# Altium project MyCar.PrjPCB
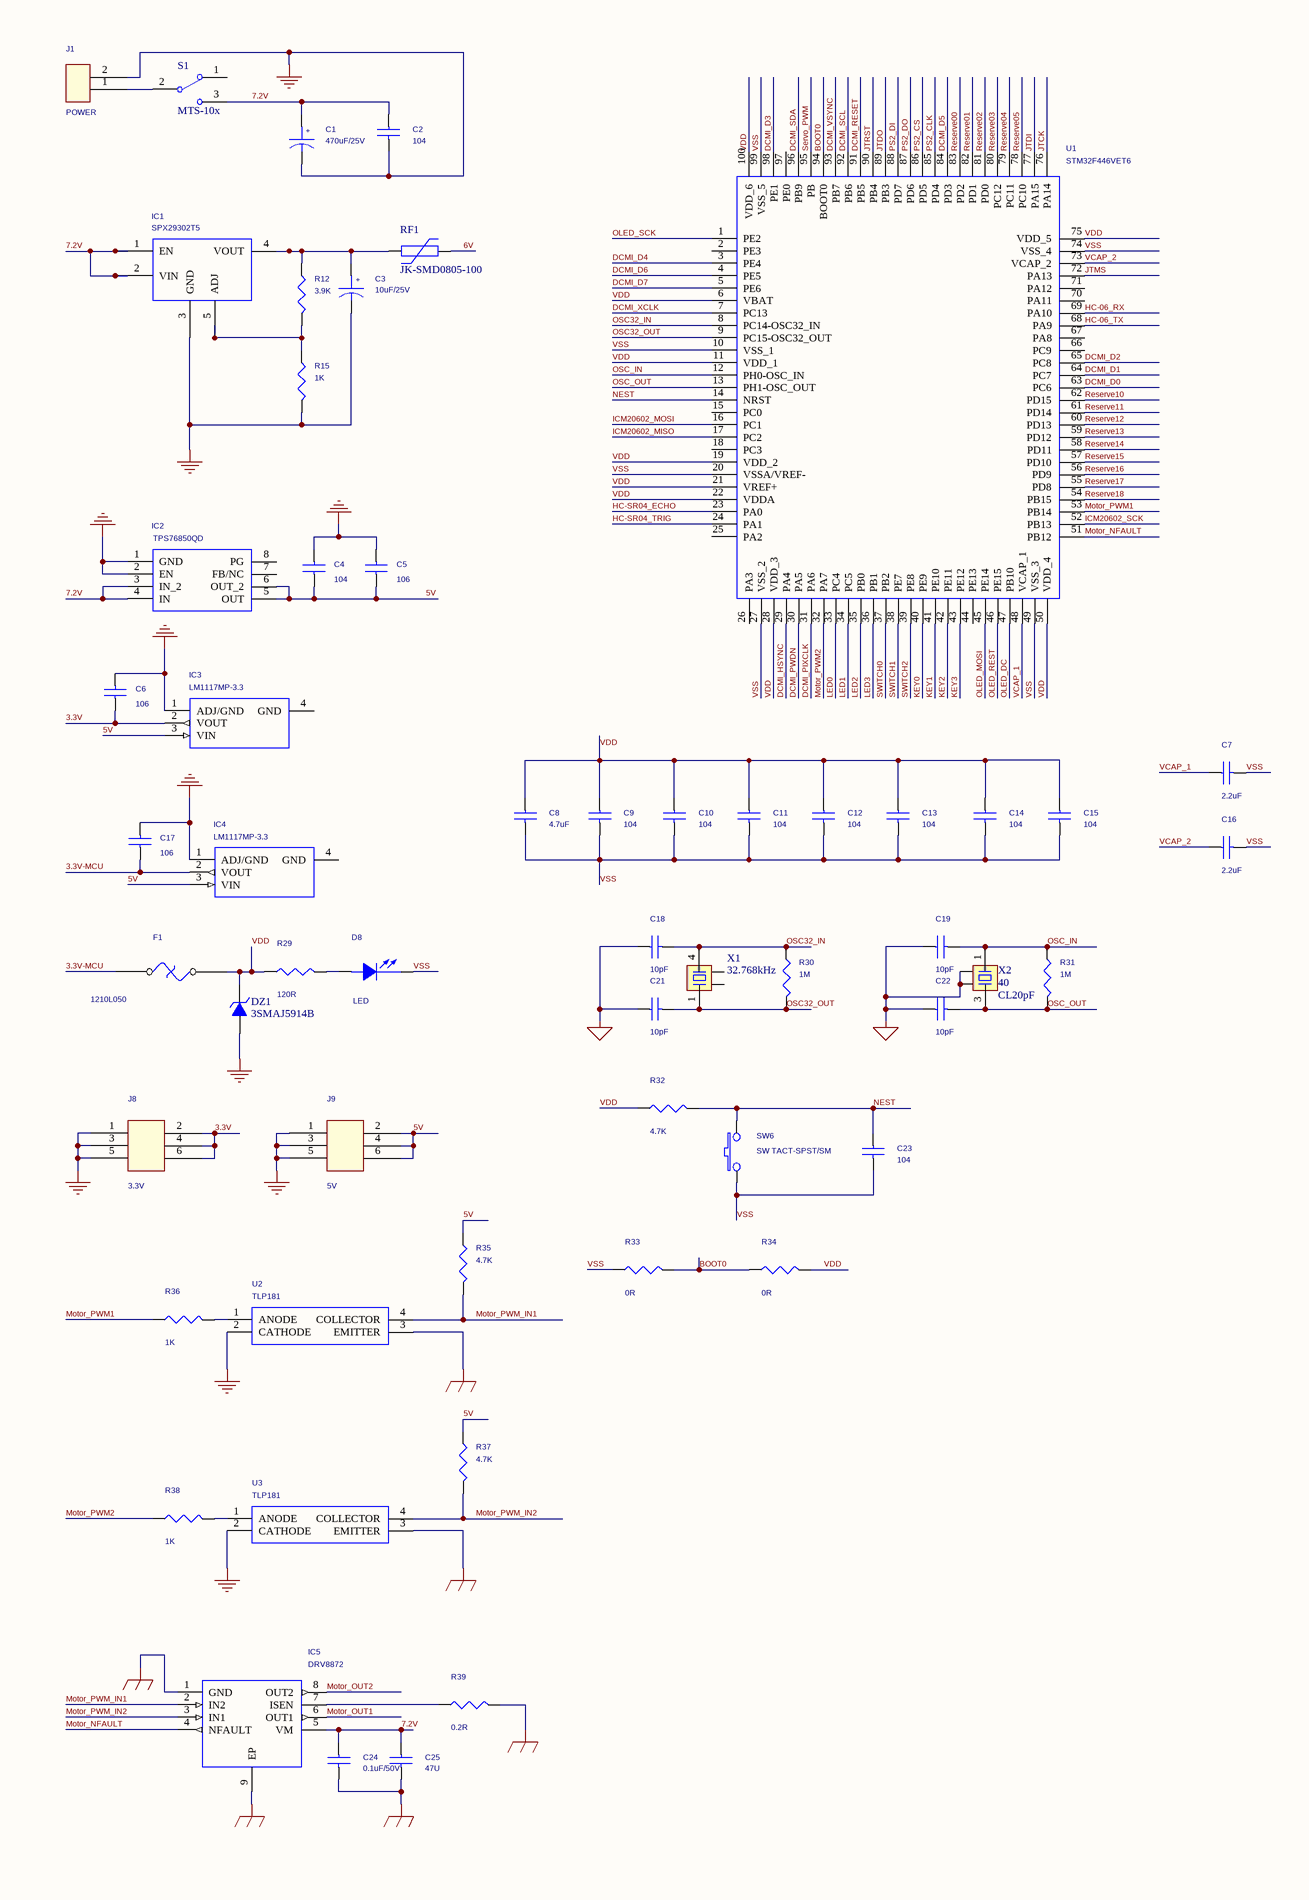
[diagram p0: MyCar.SchDoc, left]
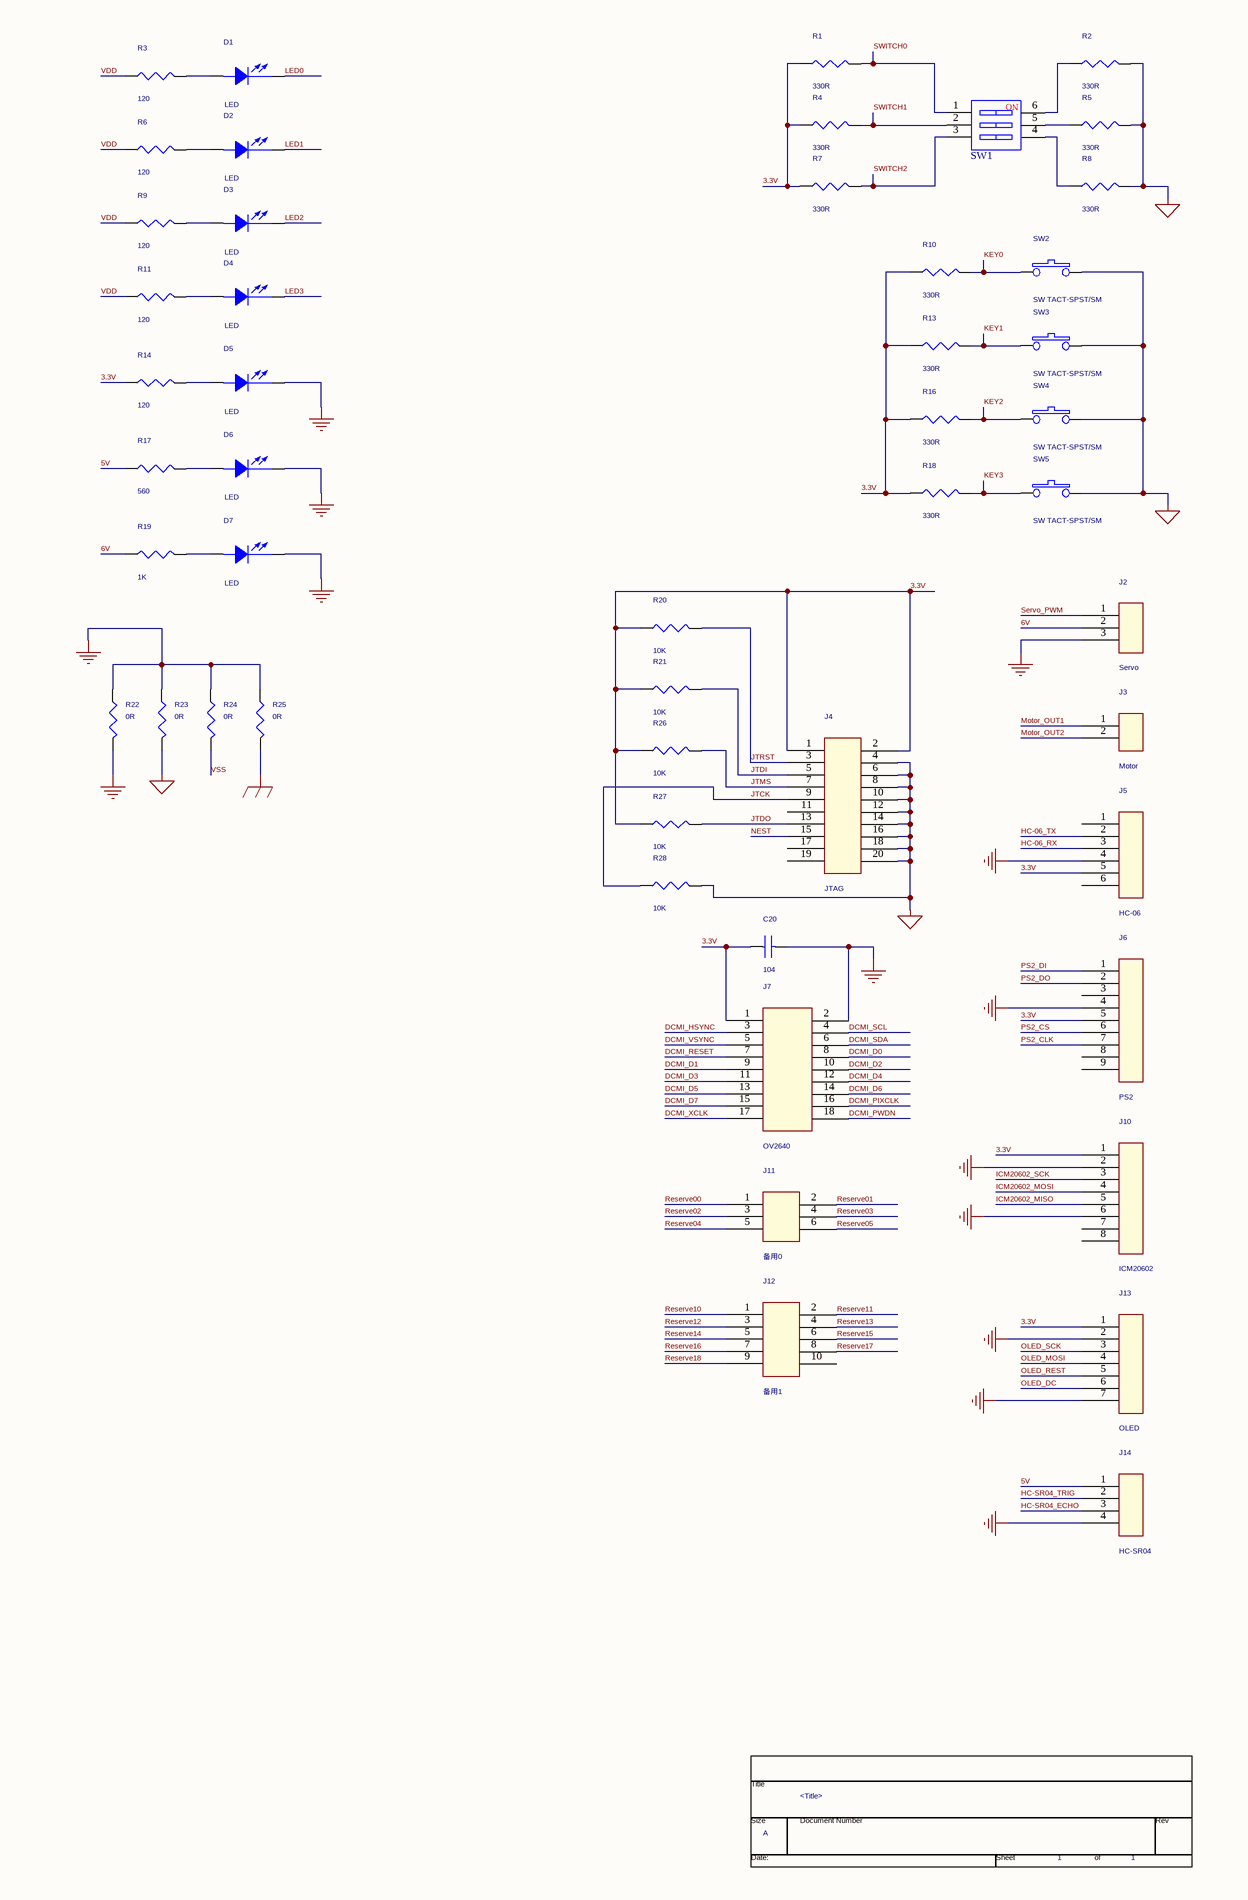
[diagram p1: MyCar.SchDoc, right]
1 sheet, 107 parts. Net scope: global (net labels, ports and power ports of the same name join across sheets).
Board file: MyCar.PcbDoc

## Sheet MyCar.SchDoc
size 513 x 386 mm

### Parts
*  Title: <Title>  Page Size: A  Page Number: 1  (hidden comment: TitleBlock0)  (graphical)
C1  470uF/25V  [CAP 3.5*8*11.5]
C2  104  [C 0805_M]
C3  10uF/25V  [CAP 2.0*5*7]
C4  104  [C 0805_M]
C5  106  [C 0805_M]
C6  106  [C 0805_M]
C7  2.2uF  [CD A(3216)]
C8  4.7uF  [C 1210_M]
C9  104  [C 0805_M]
C10  104  [C 0805_M]
C11  104  [C 0805_M]
C12  104  [C 0805_M]
C13  104  [C 0805_M]
C14  104  [C 0805_M]
C15  104  [C 0805_M]
C16  2.2uF  [CD A(3216)]
C17  106  [C 0805_M]
C18  10pF  [C 0805_M]
C19  10pF  [C 0805_M]
C20  104  [C 0805_M]
C21  10pF  [C 0805_M]
C22  10pF  [C 0805_M]
C23  104  [C 0805_M]
C24  0.1uF/50V  [C 0603_M]
C25  47U  [CAP 2.5*5*11]
D1  LED  [LED 0805R]
D2  LED  [LED 0805R]
D3  LED  [LED 0805R]
D4  LED  [LED 0805R]
D5  LED  [LED 0805R]
D6  LED  [LED 0805R]
D7  LED  [LED 0805R]
D8  LED  [LED 0805R]
DZ1  3SMAJ5914B  [SMA DO-214AC]
F1  1210L050  [0805]
IC1  SPX29302T5  [TO-263-5]
IC2  TPS76850QD  [SOIC-8]
IC3  LM1117MP-3.3  [SOT-223]
IC4  LM1117MP-3.3  [SOT-223]
IC5  DRV8872  [SOP-8]
J1  POWER  [KF2EDGK5.08-LI-2P]
J2  Servo  [HDR2.54-LI-3P]
J3  Motor  [KF2EDGK5.08-LI-2P]
J4  JTAG  [DC-2.54-L-Z-20P]
J5  HC-06  [HDR2.54-LI-6P]
J6  PS2  [PS2]
J7  OV2640  [HDR2.54-LI-2x9P]
J8  3.3V  [HDR2.54-LI-2x3P]
J9  5V  [HDR2.54-LI-2x3P]
J10  ICM20602  [HDR2.54-LI-8P]
J11  备用0  [HDR2.54-LI-2x3P]
J12  备用1  [HDR2.54-LI-2x5P]
J13  OLED  [HDR2.54-LI-7P]
J14  HC-SR04  [HDR2.54-LI-4P]
R1  330R  [R 0805_M]
R2  330R  [R 0805_M]
R3  120  [R 0805_M]
R4  330R  [R 0805_M]
R5  330R  [R 0805_M]
R6  120  [R 0805_M]
R7  330R  [R 0805_M]
R8  330R  [R 0805_M]
R9  120  [R 0805_M]
R10  330R  [R 0805_M]
R11  120  [R 0805_M]
R12  3.9K  [R 0805_M]
R13  330R  [R 0805_M]
R14  120  [R 0805_M]
R15  1K  [R 0805_M]
R16  330R  [R 0805_M]
R17  560  [R 0805_M]
R18  330R  [R 0805_M]
R19  1K  [R 0805_M]
R20  10K  [R 0805_M]
R21  10K  [R 0805_M]
R22  0R  [R 0805_M]
R23  0R  [R 0805_M]
R24  0R  [R 0805_M]
R25  0R  [R 0805_M]
R26  10K  [R 0805_M]
R27  10K  [R 0805_M]
R28  10K  [R 0805_M]
R29  120R  [R 0805_M]
R30  1M  [R 0805_M]
R31  1M  [R 0805_M]
R32  4.7K  [R 0805_M]
R33  0R  [R 0805_M]
R34  0R  [R 0805_M]
R35  4.7K  [R 0805_M]
R36  1K  [R 0805_M]
R37  4.7K  [R 0805_M]
R38  1K  [R 0805_M]
R39  0.2R  [R 1206_M]
RF1  JK-SMD0805-100  [FU 0805]
S1  MTS-10x  [MTS-10x]
SW1  CSW-3P  [CSW DIP-3P]  (value not drawn)
SW2  SW TACT-SPST/SM  [TSW DIP-6*6*4.3]
SW3  SW TACT-SPST/SM  [TSW DIP-6*6*4.3]
SW4  SW TACT-SPST/SM  [TSW DIP-6*6*4.3]
SW5  SW TACT-SPST/SM  [TSW DIP-6*6*4.3]
SW6  SW TACT-SPST/SM  [TSW DIP-6*6*4.3]
U1  STM32F446VET6  [LQFP100 14x14_N]
U2  TLP181  [SOP4_M]
U3  TLP181  [SOP4_M]
X1  32.768kHz  [OSC MC-146]
X2  40  负载电容: CL20pF  [OSC 3225-4P]

### Nets
GND: C20.2 J2.3 J5.4 J6.4 J7.2 J10.2 J10.6 J13.2 J13.7 J14.4 R22.2
GND_EARTH: C24.2 C25.2 IC5.1(GND) IC5.9(EP) R25.2 R39.2 U2.3(EMITTER) U3.3(EMITTER)
GND_POWER: C1.2 C2.2 C3.2 C4.2 C5.2 C6.2 C17.2 D5.1(CATHODE) D6.1(CATHODE) D7.1(CATHODE) DZ1.1(A) IC1.3(GND) IC2.1(GND) IC2.2(EN) IC3.1(ADJ/GND) IC4.1(ADJ/GND) J1.2 J8.1 J8.3 J8.5 J9.1 J9.3 J9.5 R15.2 R22.1 R23.1 R24.1 R25.1 U2.2(CATHODE) U3.2(CATHODE)
GND_SIGNAL: C18.1 C19.1 C21.1 C22.1 J4.4 J4.6 J4.8 J4.10 J4.12 J4.14 J4.16 J4.18 J4.20 R2.2 R5.2 R8.2 R23.2 R28.2 SW2.2 SW3.2 SW4.2 SW5.2 X2.2 X2.4
3.3V: C6.1 C20.1 IC3.2(VOUT) J4.1 J4.2 J5.5 J6.5 J7.1 J8.2 J8.4 J8.6 J10.1 J13.1 R1.1 R4.1 R7.1 R10.1 R13.1 R14.1 R16.1 R18.1 R20.1 R21.1 R26.1 R27.1
3.3V-MCU: C17.1 F1.1 IC4.2(VOUT)
5V: C4.1 C5.1 IC2.5(OUT) IC2.6(OUT_2) IC3.3(VIN) IC4.3(VIN) J9.2 J9.4 J9.6 J14.1 R17.1 R35.1 R37.1
6V: J2.2 R19.1 RF1.2
7.2V: C1.1 C2.1 C24.1 C25.1 IC1.1(EN) IC1.2(VIN) IC2.3(IN_2) IC2.4(IN) IC5.5(VM) S1.3
BOOT0: R33.2 R34.1 U1.94(BOOT0)
DCMI_D0: J7.8 U1.63(PC6)
DCMI_D1: J7.9 U1.64(PC7)
DCMI_D2: J7.10 U1.65(PC8)
DCMI_D3: J7.11 U1.98(PE1)
DCMI_D4: J7.12 U1.3(PE4)
DCMI_D5: J7.13 U1.84(PD3)
DCMI_D6: J7.14 U1.4(PE5)
DCMI_D7: J7.15 U1.5(PE6)
DCMI_HSYNC: J7.3 U1.29(PA4)
DCMI_PIXCLK: J7.16 U1.31(PA6)
DCMI_PWDN: J7.18 U1.30(PA5)
DCMI_RESET: J7.7 U1.91(PB5)
DCMI_SCL: J7.4 U1.92(PB6)
DCMI_SDA: J7.6 U1.96(PB9)
DCMI_VSYNC: J7.5 U1.93(PB7)
DCMI_XCLK: J7.17 U1.7(PC13)
HC-06_RX: J5.3 U1.69(PA10)
HC-06_TX: J5.2 U1.68(PA9)
HC-SR04_ECHO: J14.3 U1.23(PA0)
HC-SR04_TRIG: J14.2 U1.24(PA1)
ICM20602_MISO: J10.5 U1.17(PC2)
ICM20602_MOSI: J10.4 U1.16(PC1)
ICM20602_SCK: J10.3 U1.52(PB13)
JTCK: J4.9 R28.1 U1.76(PA14)
JTDI: J4.5 R21.2 U1.77(PA15)
JTDO: J4.13 R27.2 U1.89(PB3)
JTMS: J4.7 R26.2 U1.72(PA13)
JTRST: J4.3 R20.2 U1.90(PB4)
KEY0: R10.2 SW2.1 U1.40(PE9)
KEY1: R13.2 SW3.1 U1.41(PE10)
KEY2: R16.2 SW4.1 U1.42(PE11)
KEY3: R18.2 SW5.1 U1.43(PE12)
LED0: D1.1(CATHODE) U1.33(PC4)
LED1: D2.1(CATHODE) U1.34(PC5)
LED2: D3.1(CATHODE) U1.35(PB0)
LED3: D4.1(CATHODE) U1.36(PB1)
Motor_NFAULT: IC5.4(NFAULT) U1.51(PB12)
Motor_OUT1: IC5.6(OUT1) J3.1
Motor_OUT2: IC5.8(OUT2) J3.2
Motor_PWM1: R36.1 U1.53(PB14)
Motor_PWM2: R38.1 U1.32(PA7)
Motor_PWM_IN1: IC5.2(IN2) R35.2 U2.4(COLLECTOR)
Motor_PWM_IN2: IC5.3(IN1) R37.2 U3.4(COLLECTOR)
NEST: C23.1 J4.15 R32.2 SW6.2 U1.14(NRST)
OLED_DC: J13.6 U1.47(PB10)
OLED_MOSI: J13.4 U1.45(PE14)
OLED_REST: J13.5 U1.46(PE15)
OLED_SCK: J13.3 U1.1(PE2)
OSC32_IN: C18.2 R30.1 U1.8(PC14-OSC32_IN) X1.4
OSC32_OUT: C21.2 R30.2 U1.9(PC15-OSC32_OUT) X1.1
OSC_IN: C19.2 R31.1 U1.12(PH0-OSC_IN) X2.1
OSC_OUT: C22.2 R31.2 U1.13(PH1-OSC_OUT) X2.3
PS2_CLK: J6.7 U1.85(PD4)
PS2_CS: J6.6 U1.86(PD5)
PS2_DI: J6.1 U1.88(PD7)
PS2_DO: J6.2 U1.87(PD6)
Reserve00: J11.1 U1.83(PD2)
Reserve01: J11.2 U1.82(PD1)
Reserve02: J11.3 U1.81(PD0)
Reserve03: J11.4 U1.80(PC12)
Reserve04: J11.5 U1.79(PC11)
Reserve05: J11.6 U1.78(PC10)
Reserve10: J12.1 U1.62(PD15)
Reserve11: J12.2 U1.61(PD14)
Reserve12: J12.3 U1.60(PD13)
Reserve13: J12.4 U1.59(PD12)
Reserve14: J12.5 U1.58(PD11)
Reserve15: J12.6 U1.57(PD10)
Reserve16: J12.7 U1.56(PD9)
Reserve17: J12.8 U1.55(PD8)
Reserve18: J12.9 U1.54(PB15)
Servo_PWM: J2.1 U1.95(PB)
SWITCH0: R1.2 SW1.1 U1.37(PB2)
SWITCH1: R4.2 SW1.2 U1.38(PE7)
SWITCH2: R7.2 SW1.3 U1.39(PE8)
VCAP_1: C7.1 U1.48(VCAP_1)
VCAP_2: C16.1 U1.73(VCAP_2)
VDD: C8.1 C9.1 C10.1 C11.1 C12.1 C13.1 C14.1 C15.1 DZ1.2(K) F1.2 R3.1 R6.1 R9.1 R11.1 R29.1 R32.1 R34.2 U1.6(VBAT) U1.11(VDD_1) U1.19(VDD_2) U1.21(VREF+) U1.22(VDDA) U1.28(VDD_3) U1.50(VDD_4) U1.75(VDD_5) U1.100(VDD_6)
VSS: C7.2 C8.2 C9.2 C10.2 C11.2 C12.2 C13.2 C14.2 C15.2 C16.2 C23.2 D8.1(CATHODE) R24.2 R33.1 SW6.1 U1.10(VSS_1) U1.20(VSSA/VREF-) U1.27(VSS_2) U1.49(VSS_3) U1.74(VSS_4) U1.99(VSS_5)
NetC3_1: C3.1 IC1.4(VOUT) R12.1 RF1.1
NetD1_2: D1.2(ANODE) R3.2
NetD2_2: D2.2(ANODE) R6.2
NetD3_2: D3.2(ANODE) R9.2
NetD4_2: D4.2(ANODE) R11.2
NetD5_2: D5.2(ANODE) R14.2
NetD6_2: D6.2(ANODE) R17.2
NetD7_2: D7.2(ANODE) R19.2
NetD8_2: D8.2(ANODE) R29.2
NetIC1_5: IC1.5(ADJ) R12.2 R15.1
NetIC5_7: IC5.7(ISEN) R39.1
NetJ1_1: J1.1 S1.2
NetR2_1: R2.1 SW1.6
NetR5_1: R5.1 SW1.5
NetR8_1: R8.1 SW1.4
NetR36_2: R36.2 U2.1(ANODE)
NetR38_2: R38.2 U3.1(ANODE)

Not connected (* = marked no-connect by the designer): IC2 7(FB/NC) 8(PG); IC3 4(GND); IC4 4(GND); J4 11 17 19; J5 1 6; J6 3 8 9; J10 7 8; J12 10; S1 1; U1 2(PE3) 15(PC0) 18(PC3) 25(PA2) 26(PA3) 44(PE13) 66(PC9) 67(PA8) 70(PA11) 71(PA12) 97(PE0); X1 2 3

### Notes on the sheet
- (in symbol CAP POL) +
- (in symbol CSW-3P) NO
- (in symbol TitleBlock0) Title; Size; Document Number; Rev; Date:; Sheet; of

### Library data of the parts
C1 C3 = CAP POL: CLASS: Discrete
C2 C4-C25 = CAP NP: CLASS: Discrete
D1-D8 = LED: CLASS: Discrete
DZ1 = 1N4619: 3.0瓦表面贴装硅稳压二极管; BOM名称: 3V/0.5W稳压管; 版权归属: 源创客; 学习资源: www.ooocke.com
F1 = FUSE THERMAL: CLASS: Discrete
IC1 = SPX29302T5: CLASS: IC
IC2 = TPS76850QD: ULTRALOW QUIESCENT CURRENT 250-mA  LOW DROPOUT VOLTAGE REGULATORS; Manufacturer_Name: Texas Instruments; CLASS: IC; Mouser Price/Stock: https://www.mouser.com/Search/Refine.aspx?Keyword=595-TPS76850QD; Mouser Part Number: 595-TPS76850QD; Manufacturer_Part_Number: TPS76850QD; Datasheet Link: http://www.ti.com/lit/gpn/tps768; Arrow Price/Stock: https://www.arrow.com/en/products/tps76850qd/texas-instruments; Arrow Part Number: TPS76850QD
IC3 IC4 = LM1117MP-3.3: Space saving 800-mA low-dropout linear regulator with internal current limit; Manufacturer_Name: Texas Instruments; CLASS: IC; Arrow Part Number: LM1117MP-3.3; Arrow Price/Stock: https://www.arrow.com/en/products/lm1117mp-3.3nopb/texas-instruments; Datasheet Link: http://docs-emea.rs-online.com/webdocs/0780/0900766b807800d2.pdf; Height: 1.8 mm; Manufacturer_Part_Number: LM1117MP-3.3; Mouser Part Number: 926-LM1117MP-3.3NOPB; Mouser Price/Stock: https://www.mouser.co.uk/ProductDetail/Texas-Instruments/LM1117MP-33-NOPB?qs=X1J7HmVL2ZFn4x9DZ4T2hA%3D%3D
IC5 = DRV8872: 3.6A Brushed DC Motor Driver With Fault Reporting (PWM Ctrl); Manufacturer_Name: Texas Instruments; Manufacturer_Part_Number: DRV8872DDAR; Arrow Part Number: DRV8872DDAR; Arrow Price/Stock: https://www.arrow.com/en/products/drv8872ddar/texas-instruments; Datasheet Link: http://www.ti.com/lit/gpn/drv8872; Height: 1.7 mm; Mouser Part Number: 595-DRV8872DDAR; Mouser Price/Stock: https://www.mouser.co.uk/ProductDetail/Texas-Instruments/DRV8872DDAR?qs=Fobv33ltQGgHyGKgoxjXAw%3D%3D
J1 = CON2: CLASS: IO
J2 = CON3: CLASS: IO
J3 = CON2
J4 = CON20A: CLASS: IO
J5 = CON6: CLASS: IO
J6 = CON9: CLASS: IO
J7 = CON18A: CLASS: IO
J8 J9 J11 = CON6A: CLASS: IO
J10 = CON8: CLASS: IO
J12 = CON10A: CLASS: IO
J13 = CON7: CLASS: IO
J14 = CON4: CLASS: IO
R1-R39 = R: CLASS: Discrete
RF1 = PPTC: PPTC自恢复保险丝; 版权归属: 源创客; BOM名称: PPTC自恢复保险丝; 学习资源: www.ooocke.com
S1 = MTS-10x: MTS10x系列3脚扭子开关; 版权归属: 源创客; BOM名称: MTS10x系列3脚扭子开关; 学习资源: www.ooocke.com
SW1 = CSW-3P: 3路编码开关; 版权归属: 源创客; BOM名称: 3路编码开关; 学习资源: www.ooocke.com
SW2-SW6 = SW TACT-SPST/SM: CLASS: Discrete
U1 = STM32F446VET6: STMICROELECTRONICS - STM32F446VET6 - MCU, 32BIT, CORTEX-M4, 180MHZ, LQFP-100; CLASS: Discrete; Mouser Price/Stock: https://www.mouser.co.uk/ProductDetail/STMicroelectronics/STM32F446VET6?qs=Ok1pvOkw6%2Fq9jAtbG%252BoMSQ%3D%3D; Mouser Part Number: 511-STM32F446VET6; Manufacturer_Part_Number: STM32F446VET6; Manufacturer_Name: STMicroelectronics; Height: 1.6 mm; Datasheet Link: https://www.mouser.com/datasheet/2/389/stm32f446mc-956216.pdf; Arrow Price/Stock: https://www.arrow.com/en/products/stm32f446vet6/stmicroelectronics; Arrow Part Number: STM32F446VET6
U2 U3 = TLP181: Transistor Output Optocouplers 80V Photocoupler 3750 Vrms 100 to 600; Manufacturer_Part_Number: TLP181(GB-TPL,F); Manufacturer_Name: Toshiba; CLASS: Discrete; Mouser Price/Stock: https://www.mouser.co.uk/ProductDetail/Toshiba/TLP181GB-TPLF?qs=T%2FOtf55vL7e9K7yMG9Z%2F7g%3D%3D; Mouser Part Number: 757-TLP181GBTPLF; Height: 2.7 mm; Datasheet Link: http://www.mouser.com/ds/2/408/TLP181_datasheet_en_20091112-738932.pdf; Arrow Part Number: TLP181(GB-TPL,F)
X1 = XTAL-MC-4P: MC系列4脚晶振; BOM名称: 2脚无源脚晶振; 版权归属: 源创客; 学习资源: www.ooocke.com
X2 = XTAL-4P: 4脚无源晶振; 版权归属: 源创客; BOM名称: 4脚无源晶振; 学习资源: www.ooocke.com
* = TitleBlock0: Page Create Date: March  8, 1995; Page Count: 1; Schematic Page Count: 1; Schematic Page Number: 1